# Altium project Battery_Management.PrjPCB
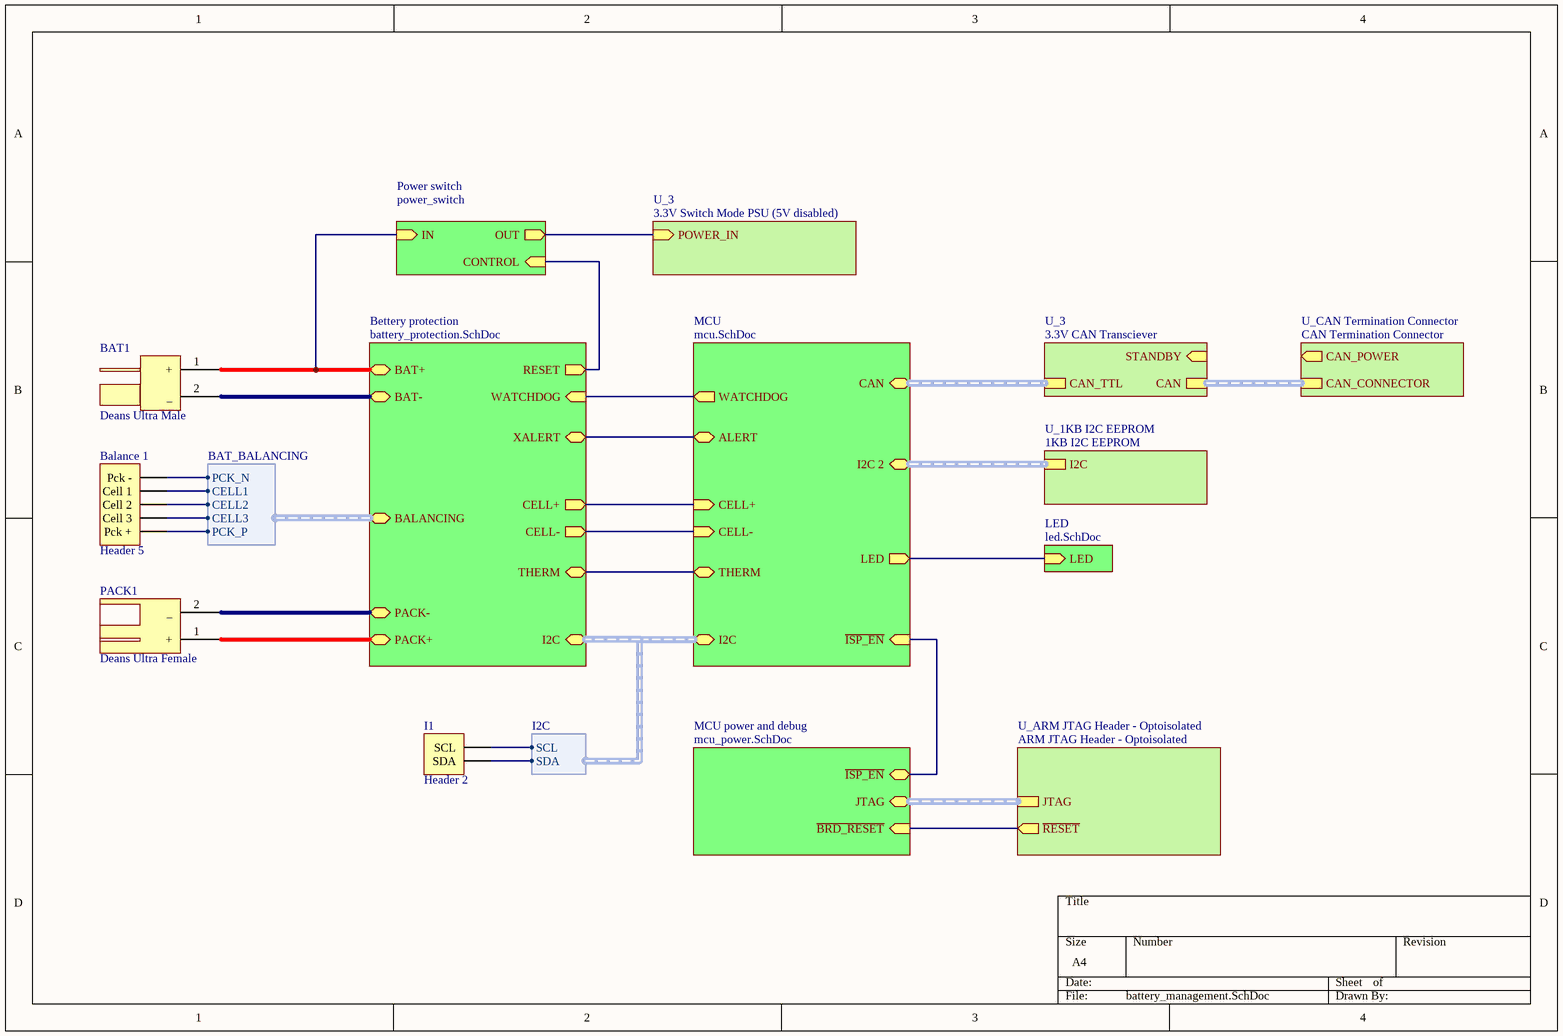
[diagram p0: battery_management.SchDoc]
4 sheets, 39 parts. Net scope: hierarchical (ports join the sheet entries above them; power ports are global).
Sheets:
  battery_management.SchDoc
    Bettery protection = battery_protection.SchDoc
      PCHG_SWITCH = Pre-CHG_switch.SchDoc
    Power switch = power_switch.SchDoc

## Sheet battery_management.SchDoc
size A4

### Parts
Balance_1  Header 5  [HDR1X5]
BAT1  Deans Ultra Male  [DEANS_MALE_SIDEWAYS - n]
I1  Header 2  [HDR1X2]
PACK1  Deans Ultra Female  [DEANS_FEMALE_SIDEWAYS - n]

### Sub-sheets
Bettery protection = battery_protection.SchDoc: BAT+, BAT-, BALANCING (harness BAT_BALANCING), PACK-, PACK+, CELL+ (out), CELL- (out), THERM, WATCHDOG (in), RESET (out), I2C (harness I2C), XALERT
LED = led.SchDoc (file not in this document): LED (in)
MCU = mcu.SchDoc (file not in this document): CELL+ (in), CELL- (in), THERM, WATCHDOG (out), LED (out), I2C (harness I2C), CAN (harness CAN_TTL), I2C 2 (harness I2C), ~{ISP_EN} (in), ALERT
MCU power and debug = mcu_power.SchDoc (file not in this document): ~{BRD_RESET} (in), JTAG (harness ARM_JTAG), ~{ISP_EN}
Power switch = power_switch: IN (in), OUT (out), CONTROL (in)
U_1KB I2C EEPROM = 1KB I2C EEPROM (file not in this document): I2C (harness I2C)
U_3 = 3.3V CAN Transciever (file not in this document): CAN_TTL (harness CAN_TTL), CAN (harness CAN), STANDBY (in)
U_3 = 3.3V Switch Mode PSU (5V disabled) (file not in this document): POWER_IN (in)
U_ARM JTAG Header - Optoisolated = ARM JTAG Header - Optoisolated (file not in this document): JTAG (harness ARM_JTAG), ~{RESET} (out)
U_CAN Termination Connector = CAN Termination Connector (file not in this document): CAN_CONNECTOR (harness CAN), CAN_POWER (out)

### Harnesses
BAT_BALANCING: PCK_N, CELL1, CELL2, CELL3, PCK_P
I2C: SCL, SDA

### Nets
GND: BAT1.2(_) ; sheet Bettery protection/BAT-
NetBalance_1_1: Balance_1.1(Pck_+) ; sheet Bettery protection/BALANCING.PCK_P
NetBalance_1_2: Balance_1.2(Cell_3) ; sheet Bettery protection/BALANCING.CELL3
NetBalance_1_3: Balance_1.3(Cell_2) ; sheet Bettery protection/BALANCING.CELL2
NetBalance_1_4: Balance_1.4(Cell_1) ; sheet Bettery protection/BALANCING.CELL1
NetBalance_1_5: Balance_1.5(Pck_-) ; sheet Bettery protection/BALANCING.PCK_N
NetBAT1_1: BAT1.1(+) ; sheet Bettery protection/BAT+, sheet Power switch/IN
NetC8_2: sheet Bettery protection/THERM, sheet MCU/THERM
NetD5_2: sheet Bettery protection/RESET, sheet Power switch/CONTROL
NetI1_1: I1.1(SDA) ; sheet Bettery protection/I2C.SDA
NetI1_2: I1.2(SCL) ; sheet Bettery protection/I2C.SCL
NetPACK1_1: PACK1.1(+) ; sheet Bettery protection/PACK+
NetPACK1_2: PACK1.2(_) ; sheet Bettery protection/PACK-
NetU1_1: sheet Bettery protection/CELL-, sheet MCU/CELL-
NetU1_2: sheet Bettery protection/CELL+, sheet MCU/CELL+
NetU1_26: sheet Bettery protection/WATCHDOG, sheet MCU/WATCHDOG
NetU1_30: sheet Bettery protection/XALERT, sheet MCU/ALERT
NetU3_5: sheet Power switch/OUT, sheet U_3/POWER_IN
(unnamed): sheet MCU/LED, sheet LED/LED
(unnamed): sheet MCU/~{ISP_EN}, sheet MCU power and debug/~{ISP_EN}
(unnamed): sheet MCU power and debug/~{BRD_RESET}, sheet U_ARM JTAG Header - Optoisolated/~{RESET}

### Buses and harness runs
harness sheet Bettery protection/I2C = sheet MCU/I2C
harness sheet MCU power and debug/JTAG = sheet U_ARM JTAG Header - Optoisolated/JTAG
harness sheet MCU/CAN = sheet U_3/CAN_TTL
harness sheet MCU/I2C 2 = sheet U_1KB I2C EEPROM/I2C
harness sheet U_3/CAN = sheet U_CAN Termination Connector/CAN_CONNECTOR

### Library data of the parts
Balance_1 = Header 5: Header, 5-Pin; LatestRevisionDate: 17-Jul-2002; LatestRevisionNote: Re-released for DXP Platform.; Publisher: Altium Limited
BAT1 = DeansUltraMale
I1 = Header 2: Header, 2-Pin; LatestRevisionDate: 17-Jul-2002; LatestRevisionNote: Re-released for DXP Platform.; Publisher: Altium Limited
PACK1 = DeansUltraFemale

## Sheet battery_protection.SchDoc
size A4
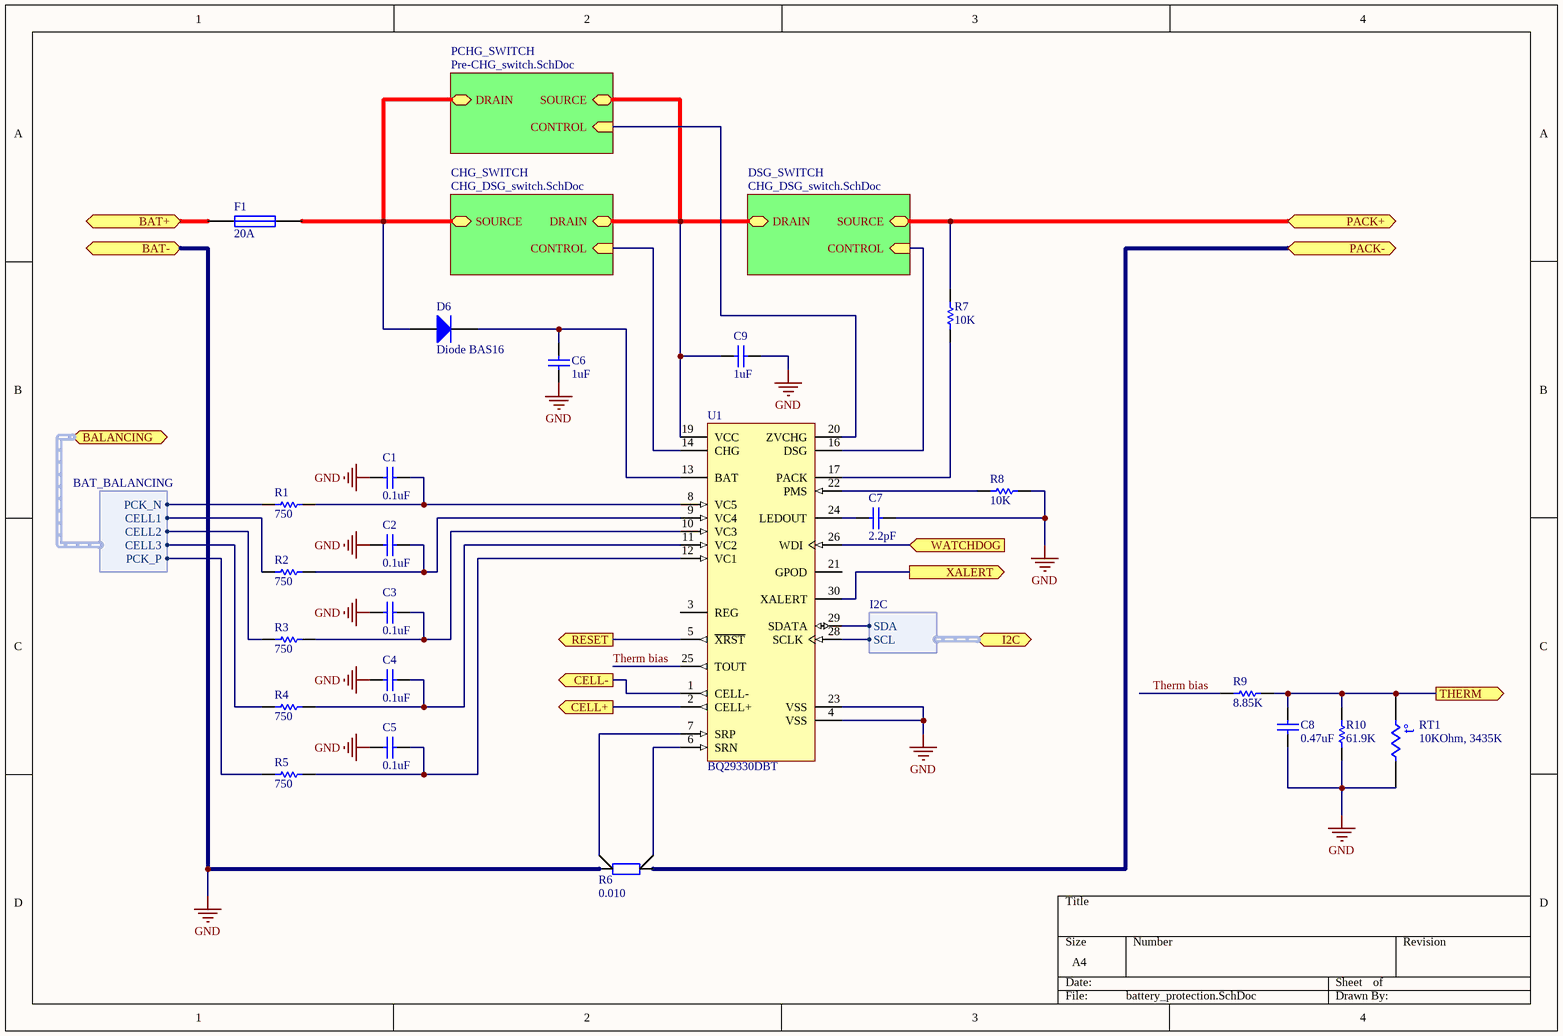
[diagram p1: battery_protection.SchDoc]

### Parts
C1  0.1uF  [RAD-0.3]
C2  0.1uF  [RAD-0.3]
C3  0.1uF  [RAD-0.3]
C4  0.1uF  [RAD-0.3]
C5  0.1uF  [RAD-0.3]
C6  1uF  [RAD-0.3]
C7  2.2pF  [RAD-0.3]
C8  0.47uF  [RAD-0.3]
C9  1uF  [RAD-0.3]
D6  Diode BAS16  [SOT-23_N]
F1  20A  [PIN-W2/E2.8]
R1  750  [AXIAL-0.3]
R2  750  [AXIAL-0.3]
R3  750  [AXIAL-0.3]
R4  750  [AXIAL-0.3]
R5  750  [AXIAL-0.3]
R6  0.010  [2512 package + Kelvin Cons - ERJ1TR Rsns]  (net tie)
R7  10K  [AXIAL-0.3]
R8  10K  [AXIAL-0.3]
R9  8.85K  [AXIAL-0.3]
R10  61.9K  [AXIAL-0.3]
RT1  10KOhm, 3435K  [6-0805_N]
U1  BQ29330DBT  [DBT30_N]

### Sub-sheets
CHG_SWITCH = CHG_DSG_switch.SchDoc (file not in this document): SOURCE, DRAIN, CONTROL (in)
DSG_SWITCH = CHG_DSG_switch.SchDoc (file not in this document): SOURCE, DRAIN, CONTROL (in)
PCHG_SWITCH = Pre-CHG_switch.SchDoc: SOURCE, DRAIN, CONTROL (in)

### Ports
BALANCING (harness BAT_BALANCING), BAT+, BAT-, CELL+ (out), CELL- (out), I2C (harness I2C), PACK+ (bidir), PACK- (bidir), RESET (out), THERM (out), WATCHDOG (in), XALERT (out)

### Harnesses
I2C: SDA, SCL
BAT_BALANCING: PCK_N, CELL1, CELL2, CELL3, PCK_P

### Nets
GND: C1.1 C2.1 C3.1 C4.1 C5.1 C6.1 C7.2 C8.1 C9.1 R8.2 R10.1 RT1.2 U1.4(VSS) U1.23(VSS) ; port BAT-
Therm bias: R9.1 U1.25(TOUT)
NetBalance_1_1: R5.2 ; port BALANCING.PCK_P
NetBalance_1_2: R4.2 ; port BALANCING.CELL3
NetBalance_1_3: R3.2 ; port BALANCING.CELL2
NetBalance_1_4: R2.2 ; port BALANCING.CELL1
NetBalance_1_5: R1.2 ; port BALANCING.PCK_N
NetBAT1_1: F1.1 ; port BAT+
NetC1_2: C1.2 R1.1 U1.8(VC5)
NetC2_2: C2.2 R2.1 U1.9(VC4)
NetC3_2: C3.2 R3.1 U1.10(VC3)
NetC4_2: C4.2 R4.1 U1.11(VC2)
NetC5_2: C5.2 R5.1 U1.12(VC1)
NetC6_2: C6.2 D6.3(K) U1.13(BAT)
NetC7_1: C7.1 U1.24(LEDOUT)
NetC8_2: C8.2 R9.2 R10.2 RT1.1 ; port THERM
NetC9_2: C9.2 U1.19(VCC) ; sheet CHG_SWITCH/DRAIN, sheet DSG_SWITCH/DRAIN, sheet PCHG_SWITCH/SOURCE
NetD2_1: U1.20(ZVCHG) ; sheet PCHG_SWITCH/CONTROL
NetD5_2: U1.5(~{XRST}) ; port RESET
NetD6_1: D6.1(A) F1.2 ; sheet CHG_SWITCH/SOURCE, sheet PCHG_SWITCH/DRAIN
NetI1_1: U1.29(SDATA) ; port I2C.SDA
NetI1_2: U1.28(SCLK) ; port I2C.SCL
NetPACK1_1: R7.2 ; port PACK+, sheet DSG_SWITCH/SOURCE
NetPACK1_2: R6.2 ; port PACK-
NetR6_3: R6.3 U1.7(SRP)
NetR6_4: R6.4 U1.6(SRN)
NetR7_1: R7.1 U1.17(PACK)
NetR8_1: R8.1 U1.22(PMS)
NetU1_1: U1.1(CELL-) ; port CELL-
NetU1_2: U1.2(CELL+) ; port CELL+
NetU1_14: U1.14(CHG) ; sheet CHG_SWITCH/CONTROL
NetU1_16: U1.16(DSG) ; sheet DSG_SWITCH/CONTROL
NetU1_26: U1.26(WDI) ; port WATCHDOG
NetU1_30: U1.30(XALERT) ; port XALERT

Not connected (* = marked no-connect by the designer): R6 1; U1 3(REG) 15(NC) 18(NC) 21(GPOD) 27(NC)

### Notes on the sheet
- (in symbol Res Thermal) t°

### Library data of the parts
C1-C9 = Cap: Capacitor; Published: 8-Jun-2000; LatestRevisionDate: 17-Jul-2002; LatestRevisionNote: Re-released for DXP Platform.; PackageReference: RAD-0.3; Publisher: Altium Limited; PackageDescription: Radial Cap, Thru-Hole; 2 Leads; 0.3 in Pin Spacing
  C1-C5: Value: 0.1uF
  C6 C9: Value: 1uF
  C7: Value: 2.2pF
  C8: Value: 0.47uF
D6 = Diode BAS16: Silicon Switching Diode for High-Speed Switching; Note: Pin 2 is not connected and not drawn.; Published: 21-Mar-2003; LatestRevisionDate: 29-May-2009; LatestRevisionNote: IPC-7351 Footprint Added.; DatasheetVersion: Oct-1999; PackageVersion: Sep-2001; PackageReference: SOT-23; Publisher: Altium Limited; PackageDescription: 3-Pin SOT-23 Package 0.95 mm Pitch, 2.5 mm Lead Span; ComponentLink1Description: Manufacturer Link; ComponentLink1URL: http://www.infineon.com/; ComponentLink2Description: Datasheet; ComponentLink2URL: http://www.infineon.com/upload/Document/cmc_upload/documents/012/5331/bas16series.pdf
F1 = Fuse 1: Fuse; Published: 8-Jun-2000; LatestRevisionDate: 17-Jul-2002; LatestRevisionNote: Re-released for DXP Platform.; PackageReference: PIN-W2/E2.8; Publisher: Altium Limited; PackageDescription: Thru-Hole; 2 Leads
R1-R5 R7-R10 = Res1: Resistor; Published: 8-Jun-2000; LatestRevisionDate: 17-Jul-2002; LatestRevisionNote: Re-released for DXP Platform.; PackageReference: AXIAL-0.3; Publisher: Altium Limited; PackageDescription: Axial Device, Thru-Hole; 2 Leads; 0.3 in Pin Spacing
  R1-R5: Value: 750
  R7 R8: Value: 10K
  R9: Value: 8.85K
  R10: Value: 61.9K
R6 = Res Kelvin: Resistor Kelvin; Published: 8-Jun-2000; LatestRevisionDate: 17-Jul-2002; LatestRevisionNote: Re-released for DXP Platform.; PackageReference: AXIAL-0.4; Publisher: Altium Limited; Value: 0.010
RT1 = Res Thermal: Thermistor, 10K, 3435K; Published: 24-Mar-1999; LatestRevisionDate: 29-May-2009; LatestRevisionNote: IPC-7351 Footprint Added.; PackageVersion: Mar-2003; PackageReference: 6-0805; Publisher: Altium Limited; PackageDescription: Chip Resistor 0805 Case Size; Code_IPC: RESC2012
U1 = BQ29330DBT: Two, Three and Four Cell Lithium or Lithium-Polymer Battery Protection AFE, -40 to 110 degC, 30-pin TSSOP (DBT), Green (RoHS & no Sb/Br); Manufacturer: Texas Instruments; Lead Acid: N; Li-Ion: Y; SubFamily: Lithium Ion Protection; DatasheetVersion: SLUS673E; PackageVersion: 38596; PackageReference: DBT30; PackageDescription: 30-Pin Thin Shrink Small Outline Package 0.5 mm Pitch; Supplier 1: Digi-Key; Supplier Part Number 1: 296-18607-5-ND; Supplier 2: Farnell; Supplier Part Number 2: 2125387; Supplier 3: Newark; Supplier Part Number 3: 58K5583; Supplier 4: Mouser; Supplier Part Number 4: 595-BQ29330DBT; Eco-Plan: Green (RoHS & no Sb/Br); Li-Polymer: Y; NiCd: N; NiMH: N; Over Voltage Protection: Y; Mounting Technology: Surface Mount; PartNumber: BQ29330DBT; Code_JEDEC: MO-153; ComponentLink1Description: Datasheet; ComponentLink1URL: http://www.ti.com/general/docs/lit/getliterature.tsp?genericPartNumber=BQ29330&fileType=pdf

## Sheet Pre-CHG_switch.SchDoc
size A4
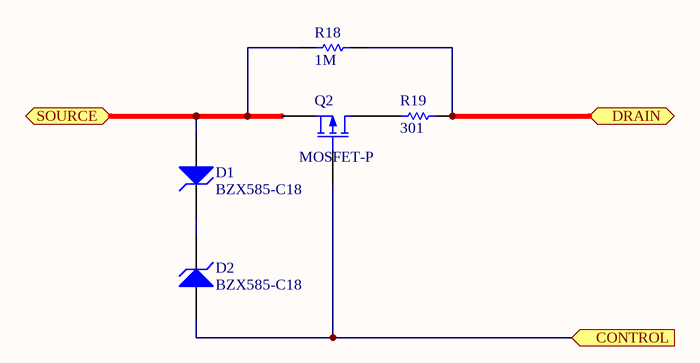
[diagram p2: Pre-CHG_switch.SchDoc]

### Parts
D1  BZX585-C18  [DIODE-0.7]
D2  BZX585-C18  [DIODE-0.7]
Q2  MOSFET-P  [E3]
R18  1M  [AXIAL-0.3]
R19  301  [AXIAL-0.3]

### Ports
CONTROL (in), DRAIN (bidir), SOURCE (bidir)

### Nets
NetC9_2: D1.1(A) Q2.3(S) R18.1 ; port SOURCE
NetD1_2: D1.2(K) D2.2(K)
NetD2_1: D2.1(A) Q2.2(G) ; port CONTROL
NetD6_1: R18.2 R19.2 ; port DRAIN
NetQ2_1: Q2.1(D) R19.1

### Library data of the parts
D1 D2 = D Zener: Zener Diode; Published: 8-Jun-2000; LatestRevisionDate: 17-Jul-2002; LatestRevisionNote: Re-released for DXP Platform.; PackageReference: DIODE-0.7; Publisher: Altium Limited; PackageDescription: Diode, Thru-Hole; 2 Leads; 0.7 in Pin Spacing
Q2 = MOSFET-P: SI4435DDY; Published: 8-Jun-2000; LatestRevisionDate: 17-Jul-2002; LatestRevisionNote: Re-released for DXP Platform.; PackageVersion: 1995/1996; PackageReference: E3; Publisher: Altium Limited; PackageDescription: TO, Flat Index; 3 In-Line, Axial Leads; Body Dia. 4.6mm; Lead Dia. 0.5 mm (max)
R18 = Res1: Resistor; Published: 8-Jun-2000; LatestRevisionDate: 17-Jul-2002; LatestRevisionNote: Re-released for DXP Platform.; PackageReference: AXIAL-0.3; Publisher: Altium Limited; PackageDescription: Axial Device, Thru-Hole; 2 Leads; 0.3 in Pin Spacing; Value: 1M
R19 = Res1: Resistor 1W; Published: 8-Jun-2000; LatestRevisionDate: 17-Jul-2002; LatestRevisionNote: Re-released for DXP Platform.; PackageReference: AXIAL-0.3; Publisher: Altium Limited; PackageDescription: Axial Device, Thru-Hole; 2 Leads; 0.3 in Pin Spacing; Value: 301

## Sheet power_switch.SchDoc
size A4
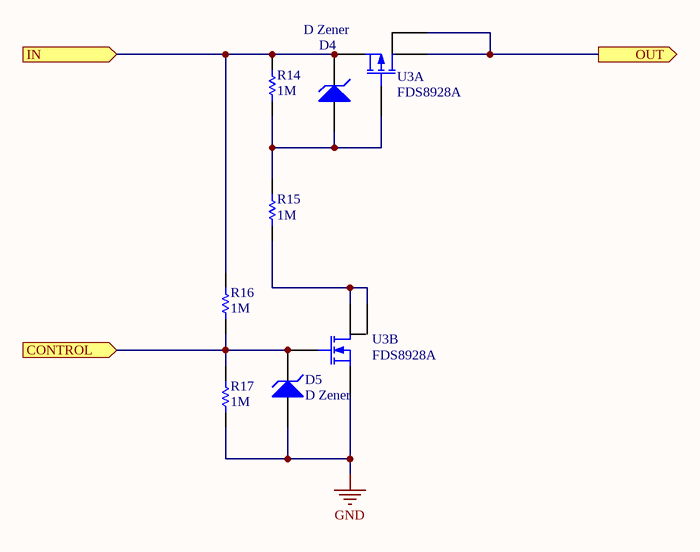
[diagram p3: power_switch.SchDoc]

### Parts
D4  D Zener  [MM3Z]
D5  D Zener  [MM3Z]
R14  1M  [R0603]
R15  1M  [R0603]
R16  1M  [R0603]
R17  1M  [R0603]
U3  FDS8928A  [FDS8928A]  (parts A,B of 2)

### Ports
CONTROL (in), IN (in), OUT (out)

### Nets
GND: D5.1(A) R17.1 U3.1(S_N)
NetBAT1_1: D4.2(K) R14.2 R16.2 U3.3(S_P) ; port IN
NetD4_1: D4.1(A) R14.1 R15.2 U3.4(G_P)
NetD5_2: D5.2(K) R16.1 R17.2 U3.2(G_N) ; port CONTROL
NetR15_1: R15.1 U3.7(D_N) U3.8(D_N)
NetU3_5: U3.5(D_P) U3.6(D_N) ; port OUT

### Library data of the parts
D4 D5 = D Zener: Zener Diode; pin to pad: 1>A 2>K; Published: 8-Jun-2000; LatestRevisionDate: 17-Jul-2002; LatestRevisionNote: Re-released for DXP Platform.; PackageReference: DIODE-0.7; Publisher: Altium Limited; farnell: 1431207
R14-R17 = Res1: Resistor; Published: 8-Jun-2000; LatestRevisionDate: 17-Jul-2002; LatestRevisionNote: Re-released for DXP Platform.; PackageReference: AXIAL-0.3; Publisher: Altium Limited; Value: 1M; farnell: 9330410
U3 = FDS8928A: MOSFET, DUAL, NP, SMD, 8-SOIC; farnell: 1467988

## Nets that join several sheets
GND: battery_management (BAT1.2), battery_protection (14 pins), power_switch (D5.1 R17.1 U3.1)
NetBalance_1_1: battery_management (Balance_1.1), battery_protection (R5.2)
NetBalance_1_2: battery_management (Balance_1.2), battery_protection (R4.2)
NetBalance_1_3: battery_management (Balance_1.3), battery_protection (R3.2)
NetBalance_1_4: battery_management (Balance_1.4), battery_protection (R2.2)
NetBalance_1_5: battery_management (Balance_1.5), battery_protection (R1.2)
NetBAT1_1: battery_management (BAT1.1), battery_protection (F1.1), power_switch (D4.2 R14.2 R16.2 U3.3)
NetC9_2: battery_protection (C9.2 U1.19), Pre-CHG_switch (D1.1 Q2.3 R18.1)
NetD2_1: battery_protection (U1.20), Pre-CHG_switch (D2.1 Q2.2)
NetD5_2: battery_protection (U1.5), power_switch (D5.2 R16.1 R17.2 U3.2)
NetD6_1: battery_protection (D6.1 F1.2), Pre-CHG_switch (R18.2 R19.2)
NetI1_1: battery_management (I1.1), battery_protection (U1.29)
NetI1_2: battery_management (I1.2), battery_protection (U1.28)
NetPACK1_1: battery_management (PACK1.1), battery_protection (R7.2)
NetPACK1_2: battery_management (PACK1.2), battery_protection (R6.2)